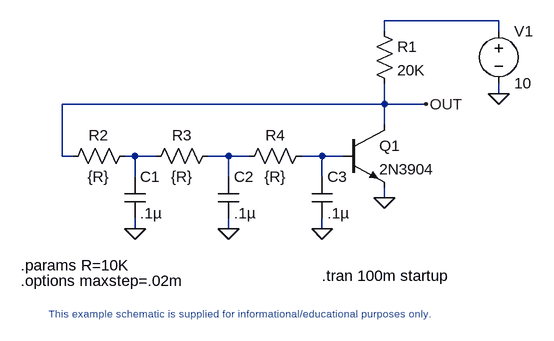
[diagram p0: schematic phaseshift2.asc]
phaseshift2.asc, the LTspice schematic file:
Version 4
SHEET 1 2124 2568
WIRE 2032 2016 1856 2016
WIRE 1856 2032 1856 2016
WIRE 2032 2032 2032 2016
WIRE 2032 2128 2032 2112
WIRE 1856 2144 1856 2112
WIRE 1856 2144 1360 2144
WIRE 1920 2144 1856 2144
WIRE 1856 2176 1856 2144
WIRE 1360 2224 1360 2144
WIRE 1376 2224 1360 2224
WIRE 1472 2224 1456 2224
WIRE 1504 2224 1472 2224
WIRE 1616 2224 1584 2224
WIRE 1648 2224 1616 2224
WIRE 1760 2224 1728 2224
WIRE 1792 2224 1760 2224
WIRE 1472 2256 1472 2224
WIRE 1616 2256 1616 2224
WIRE 1760 2256 1760 2224
WIRE 1856 2288 1856 2272
WIRE 1472 2336 1472 2320
WIRE 1616 2336 1616 2320
WIRE 1760 2336 1760 2320
FLAG 1856 2288 0
FLAG 1760 2336 0
FLAG 1616 2336 0
FLAG 1472 2336 0
FLAG 2032 2128 0
FLAG 1920 2144 OUT
SYMBOL npn 1792 2176 R0
SYMATTR InstName Q1
SYMATTR Value 2N3904
SYMBOL res 1840 2016 R0
SYMATTR InstName R1
SYMATTR Value 20K
SYMBOL res 1472 2208 R90
WINDOW 0 0 56 VBottom 2
WINDOW 3 32 56 VTop 2
SYMATTR InstName R2
SYMATTR Value {R}
SYMBOL cap 1456 2320 M180
WINDOW 0 24 64 Left 2
WINDOW 3 24 8 Left 2
SYMATTR InstName C1
SYMATTR Value .1µ
SYMBOL voltage 2032 2016 R0
SYMATTR InstName V1
SYMATTR Value 10
SYMBOL res 1600 2208 R90
WINDOW 0 0 56 VBottom 2
WINDOW 3 32 56 VTop 2
SYMATTR InstName R3
SYMATTR Value {R}
SYMBOL res 1744 2208 R90
WINDOW 0 0 56 VBottom 2
WINDOW 3 32 56 VTop 2
SYMATTR InstName R4
SYMATTR Value {R}
SYMBOL cap 1600 2320 M180
WINDOW 0 24 64 Left 2
WINDOW 3 24 8 Left 2
SYMATTR InstName C2
SYMATTR Value .1µ
SYMBOL cap 1744 2320 M180
WINDOW 0 24 64 Left 2
WINDOW 3 24 8 Left 2
SYMATTR InstName C3
SYMATTR Value .1µ
TEXT 1760 2408 Left 2 !.tran 100m startup
TEXT 1296 2416 Left 2 !.options maxstep=.02m
TEXT 1296 2392 Left 2 !.params R=10K
TEXT 1624 2456 Top 1 ;This example schematic is supplied for informational/educational purposes only.

The netlist it stands for:
* phaseshift2.asc
Q1 OUT N004 0 0 2N3904
R1 N001 OUT 20K
R2 N002 OUT {R}
C1 0 N002 .1µ
V1 N001 0 10
R3 N003 N002 {R}
R4 N004 N003 {R}
C2 0 N003 .1µ
C3 0 N004 .1µ
.model NPN NPN
.model PNP PNP
.lib standard.bjt
.tran 100m startup
.options maxstep=.02m
.params R=10K
* This example schematic is supplied for informational/educational purposes only.
.backanno
.end